# Altium schematic sheet 3_FPGA.SchDoc: AX309  Http://www.heijin.org
size OrCAD A; DocumentNumber: 3; Revision: 1.0; SheetNumber: 3; SheetTotal: 7; PageSetup: Record=PageOptions|CenterHorizontal=True|CenterVertical=True|PrintScale=1.03|XCorrection=1.00|YCorrection=1.00|PrintKind=0|BorderSize=5000000|LeftOffset=0|BottomOffset=0|Orientation=2|PaperLength=1000|PaperWidth=1000|Scale=100|PaperSource=7|PrintQuality=-4|MediaType=1|DitherType=10|PrintScaleMode=1|PaperKind=A4|PaperIndex=9
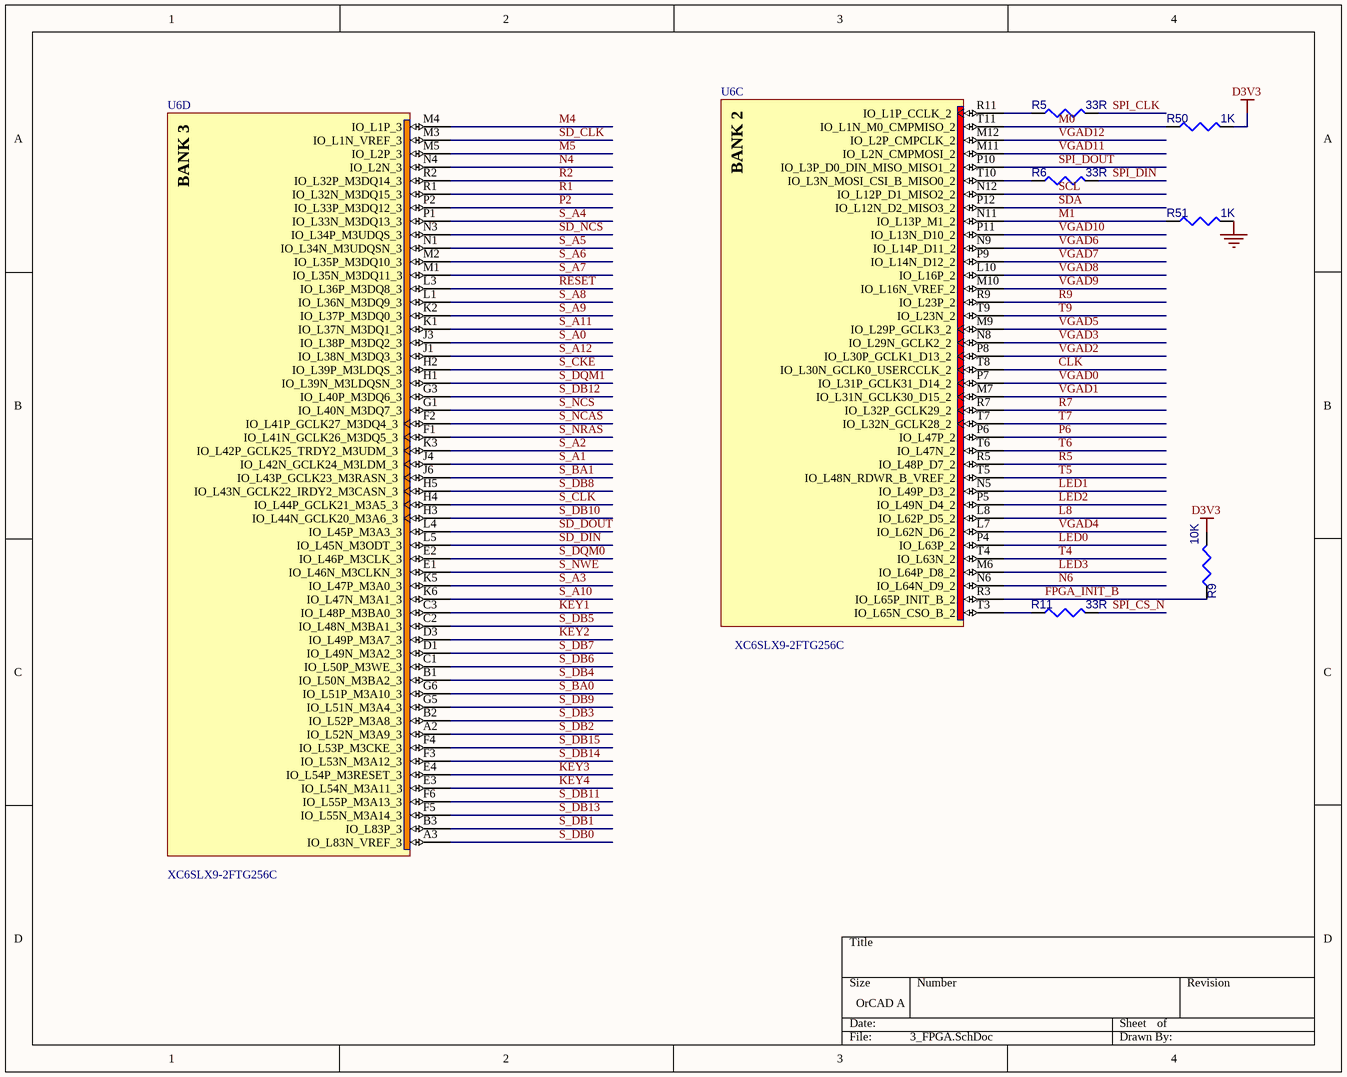
[diagram p0: 3_FPGA.SchDoc]

## Parts
R5  33R  [0603]
R6  33R  [0603]
R9  10K  [0603]
R11  33R  [0603]
R50  1K  [0603]
R51  1K  [0603]
U6  XC6SLX9-2FTG256C  [FTG256]  (parts C,D of 7)

## Nets
D3V3: R9.2 R50.2
GND: R51.2
CLK: U6.T8(IO_L30N_GCLK0_USERCCLK_2)
FPGA_INIT_B: R9.1 U6.R3(IO_L65P_INIT_B_2)
KEY1: U6.C3(IO_L48P_M3BA0_3)
KEY2: U6.D3(IO_L49P_M3A7_3)
KEY3: U6.E4(IO_L54P_M3RESET_3)
KEY4: U6.E3(IO_L54N_M3A11_3)
L8: U6.L8(IO_L62P_D5_2)
LED0: U6.P4(IO_L63P_2)
LED1: U6.N5(IO_L49P_D3_2)
LED2: U6.P5(IO_L49N_D4_2)
LED3: U6.M6(IO_L64P_D8_2)
M0: R50.1 U6.T11(IO_L1N_M0_CMPMISO_2)
M1: R51.1 U6.N11(IO_L13P_M1_2)
M4: U6.M4(IO_L1P_3)
M5: U6.M5(IO_L2P_3)
N4: U6.N4(IO_L2N_3)
N6: U6.N6(IO_L64N_D9_2)
P2: U6.P2(IO_L33P_M3DQ12_3)
P6: U6.P6(IO_L47P_2)
R1: U6.R1(IO_L32N_M3DQ15_3)
R2: U6.R2(IO_L32P_M3DQ14_3)
R5: U6.R5(IO_L48P_D7_2)
R7: U6.R7(IO_L32P_GCLK29_2)
R9: U6.R9(IO_L23P_2)
RESET: U6.L3(IO_L36P_M3DQ8_3)
S_A0: U6.J3(IO_L38P_M3DQ2_3)
S_A1: U6.J4(IO_L42N_GCLK24_M3LDM_3)
S_A2: U6.K3(IO_L42P_GCLK25_TRDY2_M3UDM_3)
S_A3: U6.K5(IO_L47P_M3A0_3)
S_A4: U6.P1(IO_L33N_M3DQ13_3)
S_A5: U6.N1(IO_L34N_M3UDQSN_3)
S_A6: U6.M2(IO_L35P_M3DQ10_3)
S_A7: U6.M1(IO_L35N_M3DQ11_3)
S_A8: U6.L1(IO_L36N_M3DQ9_3)
S_A9: U6.K2(IO_L37P_M3DQ0_3)
S_A10: U6.K6(IO_L47N_M3A1_3)
S_A11: U6.K1(IO_L37N_M3DQ1_3)
S_A12: U6.J1(IO_L38N_M3DQ3_3)
S_BA0: U6.G6(IO_L51P_M3A10_3)
S_BA1: U6.J6(IO_L43P_GCLK23_M3RASN_3)
S_CKE: U6.H2(IO_L39P_M3LDQS_3)
S_CLK: U6.H4(IO_L44P_GCLK21_M3A5_3)
S_DB0: U6.A3(IO_L83N_VREF_3)
S_DB1: U6.B3(IO_L83P_3)
S_DB2: U6.A2(IO_L52N_M3A9_3)
S_DB3: U6.B2(IO_L52P_M3A8_3)
S_DB4: U6.B1(IO_L50N_M3BA2_3)
S_DB5: U6.C2(IO_L48N_M3BA1_3)
S_DB6: U6.C1(IO_L50P_M3WE_3)
S_DB7: U6.D1(IO_L49N_M3A2_3)
S_DB8: U6.H5(IO_L43N_GCLK22_IRDY2_M3CASN_3)
S_DB9: U6.G5(IO_L51N_M3A4_3)
S_DB10: U6.H3(IO_L44N_GCLK20_M3A6_3)
S_DB11: U6.F6(IO_L55P_M3A13_3)
S_DB12: U6.G3(IO_L40P_M3DQ6_3)
S_DB13: U6.F5(IO_L55N_M3A14_3)
S_DB14: U6.F3(IO_L53N_M3A12_3)
S_DB15: U6.F4(IO_L53P_M3CKE_3)
S_DQM0: U6.E2(IO_L46P_M3CLK_3)
S_DQM1: U6.H1(IO_L39N_M3LDQSN_3)
S_NCAS: U6.F2(IO_L41P_GCLK27_M3DQ4_3)
S_NCS: U6.G1(IO_L40N_M3DQ7_3)
S_NRAS: U6.F1(IO_L41N_GCLK26_M3DQ5_3)
S_NWE: U6.E1(IO_L46N_M3CLKN_3)
SCL: U6.N12(IO_L12P_D1_MISO2_2)
SD_CLK: U6.M3(IO_L1N_VREF_3)
SD_DIN: U6.L5(IO_L45N_M3ODT_3)
SD_DOUT: U6.L4(IO_L45P_M3A3_3)
SD_NCS: U6.N3(IO_L34P_M3UDQS_3)
SDA: U6.P12(IO_L12N_D2_MISO3_2)
SPI_CLK: R5.2
SPI_CS_N: R11.2
SPI_DIN: R6.2
SPI_DOUT: U6.P10(IO_L3P_D0_DIN_MISO_MISO1_2)
T4: U6.T4(IO_L63N_2)
T5: U6.T5(IO_L48N_RDWR_B_VREF_2)
T6: U6.T6(IO_L47N_2)
T7: U6.T7(IO_L32N_GCLK28_2)
T9: U6.T9(IO_L23N_2)
VGAD0: U6.P7(IO_L31P_GCLK31_D14_2)
VGAD1: U6.M7(IO_L31N_GCLK30_D15_2)
VGAD2: U6.P8(IO_L30P_GCLK1_D13_2)
VGAD3: U6.N8(IO_L29N_GCLK2_2)
VGAD4: U6.L7(IO_L62N_D6_2)
VGAD5: U6.M9(IO_L29P_GCLK3_2)
VGAD6: U6.N9(IO_L14P_D11_2)
VGAD7: U6.P9(IO_L14N_D12_2)
VGAD8: U6.L10(IO_L16P_2)
VGAD9: U6.M10(IO_L16N_VREF_2)
VGAD10: U6.P11(IO_L13N_D10_2)
VGAD11: U6.M11(IO_L2N_CMPMOSI_2)
VGAD12: U6.M12(IO_L2P_CMPCLK_2)
NetR5_1: R5.1 U6.R11(IO_L1P_CCLK_2)
NetR6_1: R6.1 U6.T10(IO_L3N_MOSI_CSI_B_MISO0_2)
NetR11_1: R11.1 U6.T3(IO_L65N_CSO_B_2)

## Notes on the sheet
- Title
- Size:
- Date:
- Orcad A
- Number:
- Time:
- Revision:
- Sheet
- of
- File:
- (in symbol XC6SLX9-2FTG256C, part C) BANK 2
- (in symbol XC6SLX9-2FTG256C, part D) BANK 3

## Library data of the parts
R5 R6 R11 = R_Dup3
R9 = R_Dup1
R50 R51 = R
U6 = XC6SLX9-2FTG256C: Spartan-6 LX 1.2V FPGA, 186 User I/Os, 256-Ball Fine-Pitch Thin BGA (1.0mm Pitch), Speed Grade 2, Commercial Grade, Pb-Free; DatasheetVersion: ver1.6, Nov-2010; PackageVersion: ver1.3, Oct-2007; PackageReference: FTG256; PackageDescription: 256-Ball Fine Pitch Thin Ball Grid Array 1.00 mm Pitch (FTG256) - Pb-Free; Code_JEDEC: MS-034-AAF-1*; ComponentLink1Description: Manufacturer URL; ComponentLink1URL: http://www.xilinx.com/; ComponentLink2Description: Spartan-6 Datasheet; ComponentLink2URL: http://www.xilinx.com/support/documentation/data_sheets/ds160.pdf; ComponentLink3Description: Spartan-6 Documents; ComponentLink3URL: http://www.xilinx.com/support/documentation/spartan-6.htm